# EAGLE design node (EAGLE 6.2)
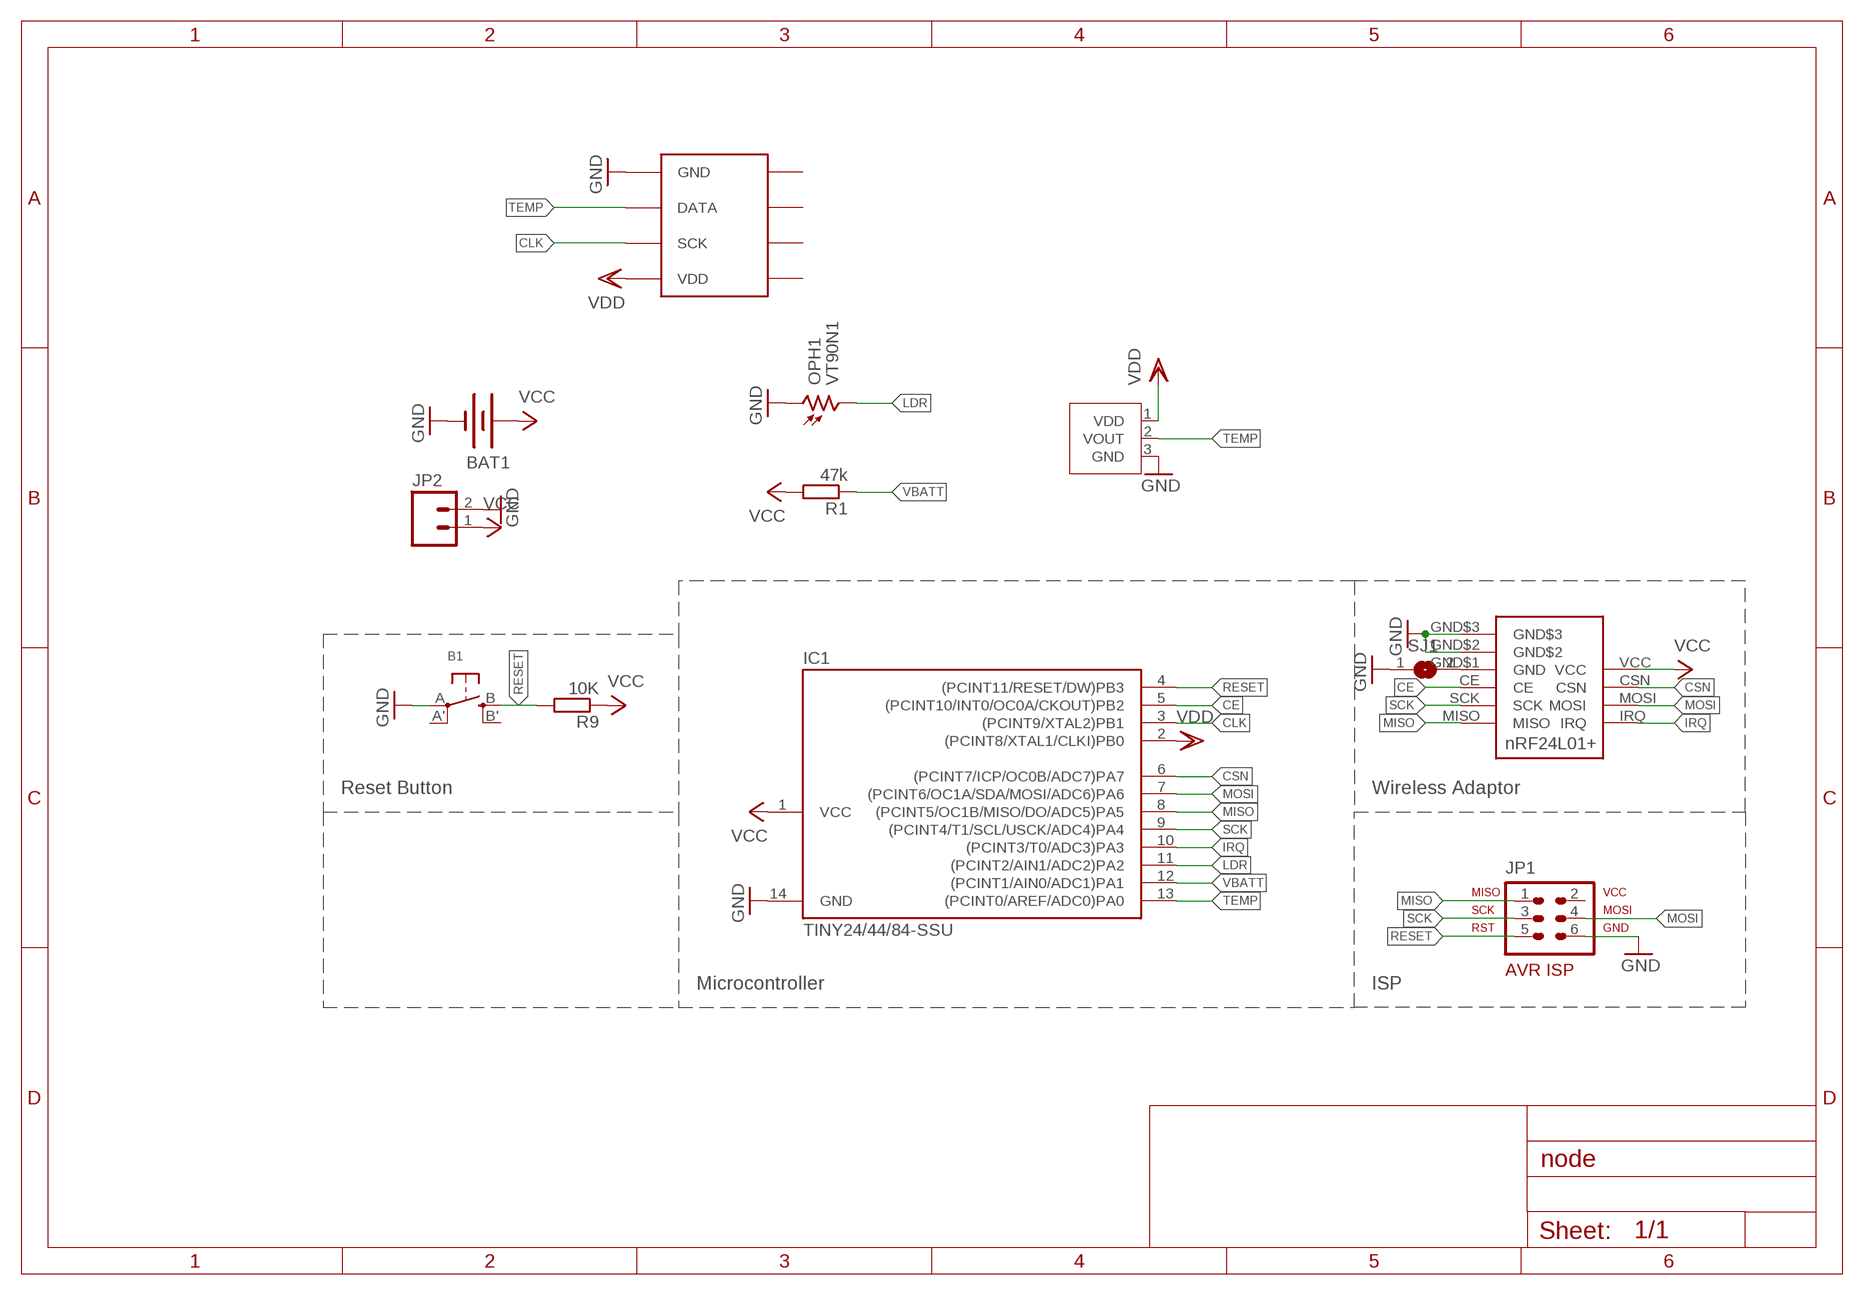
[diagram p0: schematic, sheet 1]

## Parts
B1  SWITCH_TACT_SMT  [EVQ-Q2]
BAT1  BATTERY20SMD  [BATTCON_20MM]
CHINESE1  NRF24L01+CHINESE-DUAL  [CHINESE-DUALPINOUT]
IC1  TINY24/44/84-SSU  [SOIC14]
JP1  AVR-ISP-6VERT  [AVR-ISP-6]
JP2  M02POLAR_LOCK  [MOLEX-1X2_LOCK]
OPH1  VT90N1  [VT900]
R1  47k  R-EU_R0805  [R0805]
R9  10K  R-EU_R0805  [R0805]
SHT1  SHT11  [SHT11]
SJ1  SJ  [SJ]
U$1  MCP970XTT  [SOT23]

## Nets
CE: CHINESE1.CE IC1.5((PCINT10/INT0/OC0A/CKOUT)PB2)
CLK: IC1.3((PCINT9/XTAL2)PB1) SHT1.SCK
CSN: CHINESE1.CSN IC1.6((PCINT7/ICP/OC0B/ADC7)PA7)
GND: B1.A(P) BAT1.2(-) CHINESE1.GND$2 CHINESE1.GND$3 IC1.14(GND) JP1.6 JP2.2 OPH1.1 SHT1.GND SJ1.1 U$1.3(GND)
IRQ: CHINESE1.IRQ IC1.10((PCINT3/T0/ADC3)PA3)
LDR: IC1.11((PCINT2/AIN1/ADC2)PA2) OPH1.2
MISO: CHINESE1.MISO IC1.8((PCINT5/OC1B/MISO/DO/ADC5)PA5) JP1.1
MOSI: CHINESE1.MOSI IC1.7((PCINT6/OC1A/SDA/MOSI/ADC6)PA6) JP1.4
N$11: CHINESE1.GND$1(GND) SJ1.2
RESET: B1.B(S) IC1.4((PCINT11/RESET/DW)PB3) JP1.5 R9.2
SCK: CHINESE1.SCK IC1.9((PCINT4/T1/SCL/USCK/ADC4)PA4) JP1.3
TEMP: IC1.13((PCINT0/AREF/ADC0)PA0) SHT1.DATA U$1.2(VOUT)
VBATT: IC1.12((PCINT1/AIN0/ADC1)PA1) R1.1
VCC: BAT1.1(+) CHINESE1.VCC IC1.1(VCC) JP2.1 R1.2 R9.1
VDD: IC1.2((PCINT8/XTAL1/CLKI)PB0) SHT1.VDD U$1.1(VDD)
Unconnected: B1.A'(P1) B1.B'(S1) JP1.2 SHT1.5 SHT1.6 SHT1.7 SHT1.8

## Notes on the sheet
- Reset Button | Wireless Adaptor
- Microcontroller | ISP

## Library data of the parts
B1 = microbuilder:SWITCH_TACT_SMT: SMT Tact Switches 6x6mm - Digikey: P12940SCT-ND KMR2 (4.6x2.8mm) - Digikey: 401-1426-1-ND EVQ-PQHB55 - Light Touch, 160GF (4.5x4.5mm) - Digikey: P8090SCT-ND
BAT1 = SparkFun:BATTERY: Battery Holders Various common sizes : AA, AAA, 20mm coin cell and 12mm coin cell.
CHINESE1 = nrf24l01+:NRF24L01+
IC1 = avr-6:TINY24/44/84
JP1 = avr-7:AVR-ISP-6: AVR ISP-6 Serial Programming Header
JP2 = SparkFun:M02: Header 2 Standard 2-pin 0.1" header. Use with straight break away headers (SKU : PRT-00116), right angle break away headers (PRT-00553), swiss pins (PRT-00743), machine pins (PRT-00117), and female headers (PRT-00115). Molex polarized connector foot print use with SKU : PRT-08233 with associated crimp pins and housings.
OPH1 = photo-elements:VT9: Photoconductive Cell VT900 Series Source: http://optoelectronics.perkinelmer.com/content/Datasheets/DTS_vt900seriesdatasheet.pdf
R1 R9 = rcl:R-EU_: RESISTOR, European symbol
SHT1 = sht11:SHT11
SJ1 = jumper:SJ: SMD solder JUMPER
U$1 = mcp970x:MCP970X

## Board
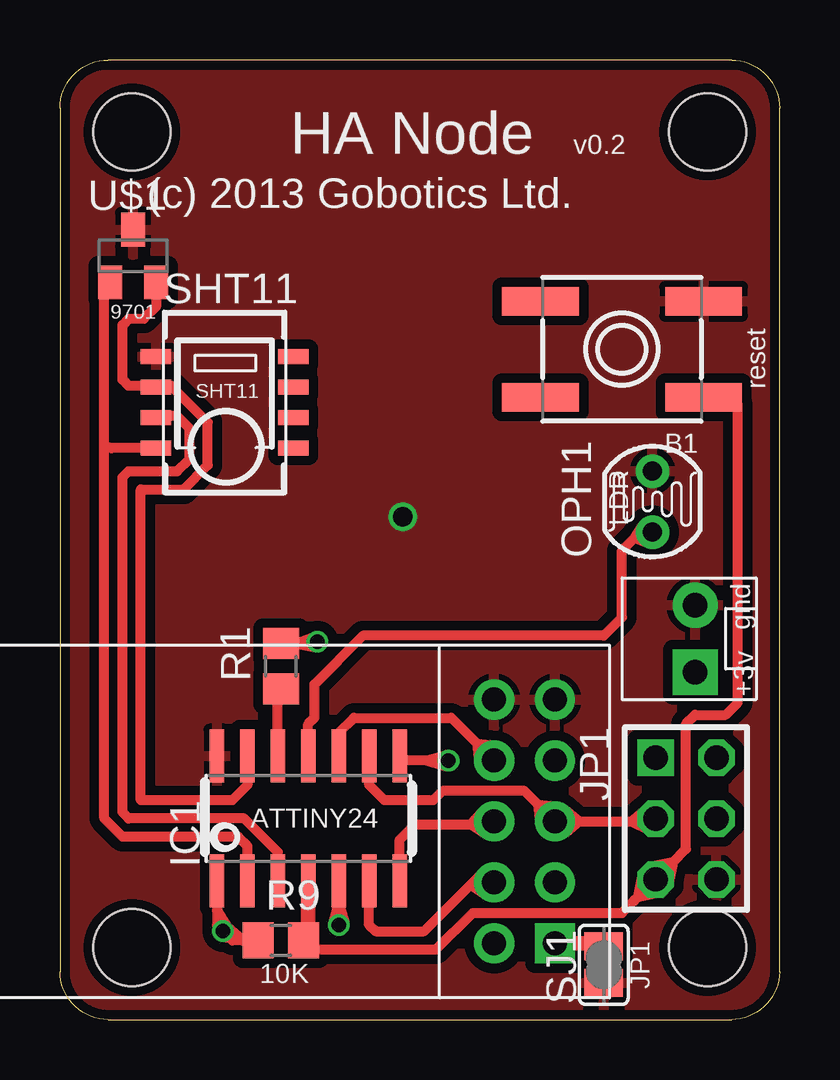
[diagram p1: board, top side]
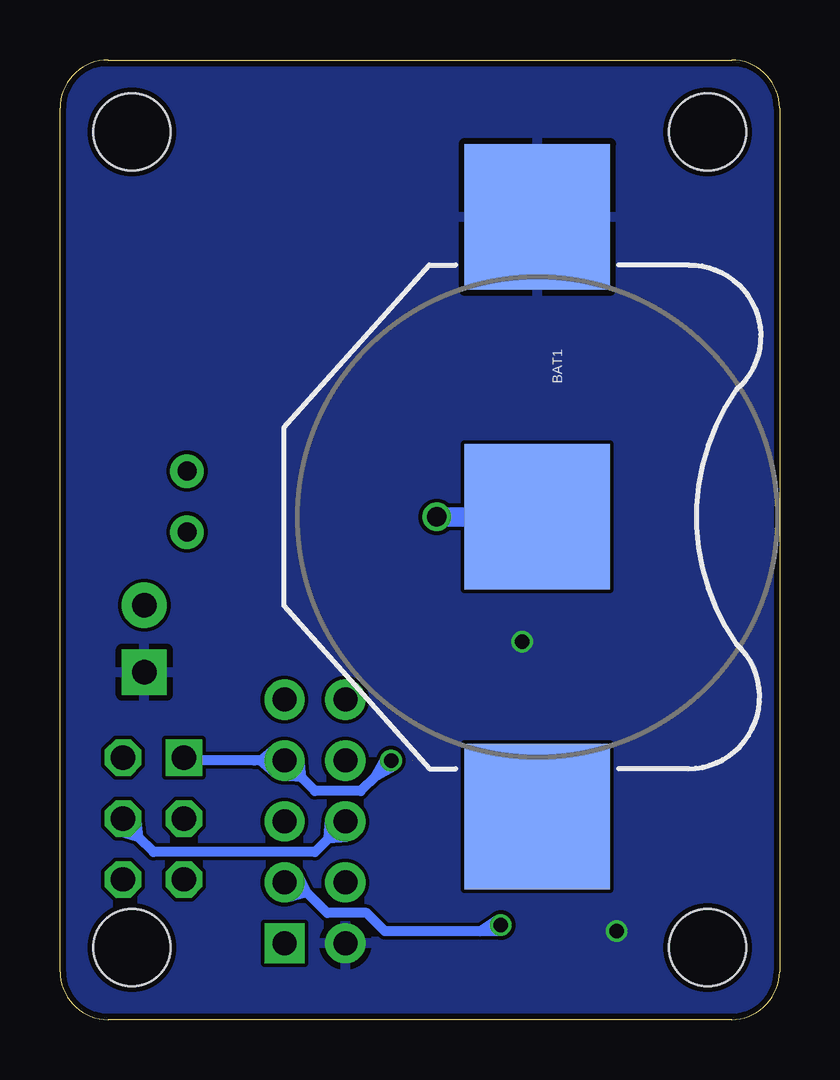
[diagram p2: board, bottom side, seen from below]

Size 30 x 40 mm. Coordinates in mm from the lower left corner, seen from the top.
Outline: 2,0 28,0 arc90 30,2 30,38 arc90 28,40 2,40 arc90 0,38 0,2 arc90 2,0
Copper layers (1*16): Top 0.035mm / dielectric 1.5mm / Bottom 0.035mm
Design rules: minimum track width 6mil, minimum drill 12mil, track to track 6mil, track to pad 6mil, pad to pad 6mil, via to via 6mil, smd to smd 0mil, copper to edge 10mil, drill to drill 10mil, minimum pad ring 10mil, minimum via ring 6mil, stop-mask expansion 2mil, vias tented up to drill 100mil, thermal gap 10mil
Holes 3.2 mm at 27,37 27,3 3,37 3,3

### Footprints (pad centres in the part's own frame; a part is rotated, then mirrored left to right if it is on the bottom)
EVQ-Q2 = smd 3.2 x 1.2: A -3.4,-2; A' 3.4,-2; B -3.4,2; B' 3.4,2
BATTCON_20MM = smd 6.07 x 6.07: 1 -12.5,0; 2 0,0; 3 12.5,0
CHINESE-DUALPINOUT = drill 1 pad 1.676: CE -10.16,0; CSN -7.62,0; GND$2 -10.16,-7.62; GND$3 -7.62,-7.62; IRQ -7.62,-5.08; MISO -10.16,-5.08; MOSI -7.62,-2.54; SCK -10.16,-2.54; VCC -7.62,2.54 | drill 1 pad 1.676 square: GND$1 -10.16,2.54
SOIC14 = smd 0.61 x 2.21: 1 -3.81,-2.603; 2 -2.54,-2.603; 3 -1.27,-2.603; 4 0,-2.603; 5 1.27,-2.603; 6 2.54,-2.603; 7 3.81,-2.603; 8 3.81,2.603; 9 2.54,2.603; 10 1.27,2.603; 11 0,2.603; 12 -1.27,2.603; 13 -2.54,2.603; 14 -3.81,2.603
AVR-ISP-6 = drill 1.016 square: 1 -2.54,-1.27 | drill 1.016 octagon: 2 -2.54,1.27; 3 0,-1.27; 4 0,1.27; 5 2.54,-1.27; 6 2.54,1.27
MOLEX-1X2_LOCK = drill 1.016 pad 1.88 square: 1 -0.127,0 | drill 1.016 pad 1.88: 2 2.667,0
VT900 = drill 0.8 pad 1.4: 1 -1.27,0; 2 1.27,0
R0805 = smd 1.3 x 1.5: 1 -0.95,0; 2 0.95,0
SHT11 = smd 1.27 x 0.635: 5 7.31,2.54; 6 7.31,3.81; 7 7.31,5.08; 8 7.31,6.35; DATA 1.59,5.08; GND 1.59,6.35; SCK 1.59,3.81; VDD 1.59,2.54
SJ = smd 1.168 x 1.6: 1 -0.762,0; 2 0.762,0
SOT23 = smd 1 x 1.4: 1 -0.95,-1.1; 2 0.95,-1.1; 3 0,1.1

### Placement (x,y rotation side)
B1  23.43,27.94 180 top
BAT1  10.1,20.95 270 bottom
CHINESE1  10.48,5.71 180 top
IC1  10.35,8.38 0 top
JP1  26.1,8.38 270 top
JP2  26.48,14.61 90 top
OPH1  24.7,21.59 270 top
R1  9.21,14.73 90 top
R9  9.21,3.3 0 top
SHT1  2.42,21.28 0 top
SJ1  22.67,2.29 90 top
U$1  3.05,31.83 0 top

### Tracks (layer width: path | path; a pad name or v marks a point on that pad's centre or on a via)
CE  (via drill 0.6)
  Top 0.406: v11.62,3.94 11.62,4.84 | 11.62,4.84 IC1.5 | 11.62,4.84 11.38,4.01 v11.62,3.94 | 11.62,4.84 11.86,4.01 v11.62,3.94
  Bottom 0.406: 11.72,3.68 11.62,3.81 v11.62,3.94 | 11.72,3.68 12.49,3.68 | 12.49,3.68 16.45,3.68 17.21,4.45 18.86,4.45 19.73,5.31 | 11.72,3.68 11.62,3.81 v11.62,3.94 | CHINESE1.CE 20.13,5.71 19.73,5.31 | 12.49,3.68 11.76,4.15 v11.62,3.94 | 12.49,3.68 11.62,3.69 v11.62,3.94 | 19.73,5.31 20.47,5.1 CHINESE1.CE | 19.73,5.31 20.07,6 CHINESE1.CE
CLK
  Top 0.406: IC1.3 9.08,6.99 7.69,8.38 2.86,8.38 2.61,8.64 2.61,22.61 2.86,22.86 4.89,22.86 5.4,23.37 5.4,24.64 4.89,25.15 4.06,25.15 SHT1.SCK
CSN
  Top 0.406: IC1.6 12.89,3.94 13.15,3.68 15.18,3.68 17.11,5.61 | 17.11,5.61 17.21,5.71 CHINESE1.CSN | 17.11,5.61 17.75,5.18 CHINESE1.CSN | 17.11,5.61 17.65,6.16 CHINESE1.CSN
GND  (via drill 0.8)
  Bottom 0.813: BAT1.2 v14.29,20.95
  pour Top (isolate 0.406): -22.29,51.82 32.32,51.82 32.32,-3.3 -22.29,-3.3
IRQ
  Top 0.406: IC1.10 11.62,11.94 12.26,12.57 16.32,12.57 17.39,11.5 | 17.39,11.5 CHINESE1.IRQ | 17.39,11.5 17.47,10.73 CHINESE1.IRQ | 17.39,11.5 18.16,11.43 CHINESE1.IRQ
LDR
  Top 0.406: 23.95,20.07 23.43,19.56 23.43,16.76 22.67,16 12.64,16 10.61,13.97 10.61,12.57 10.35,12.32 IC1.11 | 23.95,20.07 24.2,20.32 OPH1.2 | 23.95,20.07 24.53,19.85 OPH1.2 | 23.95,20.07 24.29,20.59 OPH1.2
MISO  (via drill 0.6)  (1 unrouted)
  Top 0.406: 14.23,11.05 IC1.8 14.35,10.79 15.3,10.79 | 16.13,10.56 | 15.3,10.79 | v16.2,10.79 16.13,10.56 | 16.13,10.56 v16.2,10.79 | v16.2,10.79 16.13,10.56 | v16.2,10.79 15.3,10.79 | 15.3,10.79 16.13,10.56 | v16.2,10.79 16.13,10.56 | 15.3,10.79 16.13,11.03 v16.2,10.79
  Bottom 0.406: v16.2,10.79 16.83,10.16 | 16.83,10.16 17.47,9.53 19.37,9.53 19.93,10.09 | 19.93,10.09 CHINESE1.MISO | JP1.1 24.7,10.79 21.89,10.79 | CHINESE1.MISO 21.64,10.79 | 21.64,10.79 21.89,10.79 | 21.89,10.79 | 16.83,10.16 16.41,10.92 v16.2,10.79 | 16.83,10.16 16.07,10.58 v16.2,10.79 | 19.93,10.09 20.7,10.16 CHINESE1.MISO | 19.93,10.09 20.01,10.86 CHINESE1.MISO | 21.64,10.79 21.04,11.29 CHINESE1.MISO | 21.64,10.79 21.04,10.3 CHINESE1.MISO
MOSI
  Top 0.406: IC1.7 14.16,7.49 14.8,8.13 17.11,8.13 | 17.11,8.13 17.97,8.13 CHINESE1.MOSI | 17.11,8.13 17.76,7.72 CHINESE1.MOSI | 17.11,8.13 17.64,8.69 CHINESE1.MOSI
  Bottom 0.406: CHINESE1.MOSI 18.81,7.55 | 18.81,7.55 19.37,6.99 26.1,6.99 26.72,7.6 | 26.72,7.6 27.37,8.26 JP1.4 | 26.72,7.6 27.53,7.85 JP1.4 | 26.72,7.6 26.82,8.45 JP1.4 | 18.81,7.55 18.73,8.32 CHINESE1.MOSI | 18.81,7.55 18.04,7.62 CHINESE1.MOSI
N$11
  Top 0.61: CHINESE1.GND$1 22.55,3.17 SJ1.2
RESET
  Top 0.406: R9.2 10.16,3.17 10.23,2.92 15.69,2.92 17.21,4.45 23.43,4.45 23.93,4.94 | JP1.5 25.55,6.56 | 25.55,6.56 26.1,7.11 26.1,12.32 26.48,12.7 27.75,12.7 28.26,13.21 28.26,25.65 27.63,25.65 B1.B | 23.93,4.94 24.11,5.12 | 24.11,5.12 JP1.5 | 23.93,4.94 | 23.93,4.94 | 25.55,6.56 24.72,6.39 JP1.5 | 25.55,6.56 25.38,5.73 JP1.5 | 24.11,5.12 24.94,5.29 JP1.5 | 24.11,5.12 24.28,5.96 JP1.5
  Top 0.61: IC1.4 10.35,3.75 R9.2
SCK
  Top 0.406: JP1.3 24.7,8.26 23.82,8.26 | CHINESE1.SCK 21.64,8.26 | 21.64,8.26 21.89,8.26 | 21.89,8.26 23.82,8.26 | 19.93,8.96 19.37,9.53 15.94,9.53 15.56,9.14 13.53,9.14 12.89,9.78 IC1.9 | 19.93,8.96 CHINESE1.SCK | 21.89,8.26 | 23.82,8.26 24.58,7.88 JP1.3 | 23.82,8.26 24.47,8.81 JP1.3 | 21.64,8.26 21.04,8.75 CHINESE1.SCK | 21.64,8.26 21.04,7.76 CHINESE1.SCK | 19.93,8.96 20.01,8.19 CHINESE1.SCK | 19.93,8.96 20.7,8.89 CHINESE1.SCK
TEMP
  Top 0.406: IC1.13 7.81,9.78 7.18,9.14 3.37,9.14 3.37,22.1 5.15,22.1 6.16,23.11 6.16,24.89 4.64,26.42 4.06,26.42 | 4.06,26.42 SHT1.DATA | 4.06,26.42 2.86,26.42 2.61,26.67 2.61,28.96 2.86,29.21 3.5,29.21 4,29.72 U$1.2
VBATT
  Top 0.406: IC1.12 9.08,13.65 R1.1
VCC  (via drill 0.6)
  Top 0.406: R9.1 7.61,3.3 | 7.61,3.3 7.18,3.3 v6.8,3.68 | IC1.1 6.54,4.55 | 6.54,4.55 6.54,3.94 v6.8,3.68 | R1.2 9.84,15.68 | 9.84,15.68 10.41,15.68 v10.73,15.75 | 7.61,3.3 6.96,3.87 v6.8,3.68 | 7.61,3.3 6.76,3.44 v6.8,3.68 | 6.54,4.55 6.55,3.68 v6.8,3.68 | 6.54,4.55 7.01,3.82 v6.8,3.68 | 9.84,15.68 10.68,15.5 v10.73,15.75 | 9.84,15.68 10.65,15.98 v10.73,15.75
  pour Bottom: -21.27,51.31 31.56,51.31 31.56,-2.03 -21.27,-2.03
VDD
  Top 0.406: IC1.2 7.81,7.24 7.43,7.62 2.61,7.62 1.84,8.38 1.84,23.88 | 1.84,23.88 1.84,30.22 U$1.1 | SHT1.VDD 2.15,23.82 1.84,23.88

### Text on the board
_tsilk: HA Node | v0.2 | (c) 2013 Gobotics Ltd. | 9701 | SHT11 | reset | LDR | gnd | +3v | ATTINY24 | 10K | JP1